# Altium schematic sheet Programmable Load.SchDoc
size 431 x 279 mm; SheetNumber: 5; SheetTotal: 6
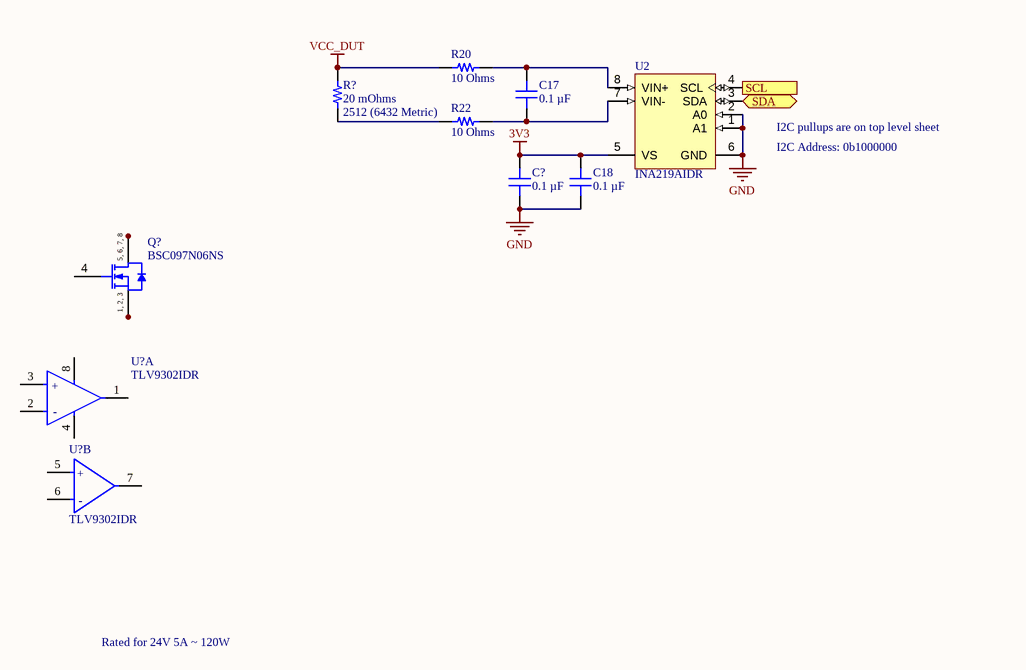
[diagram p0: Programmable Load.SchDoc]

## Parts
(Parts that share a designator on the sheet are numbered #1, #2 ... from top to bottom, then left to right.)
C17  0.1 µF  [CAP 0603_1608]
C18  0.1 µF  [CAP 0603_1608]
C?  0.1 µF  [CAP 0603_1608]
Q?  BSC097N06NS  [INF-PG-TDSON-8-04_V]
R20  10 Ohms  [RES 0603_1608]
R22  10 Ohms  [RES 0603_1608]
R?  20 mOhms  Package / Case: 2512 (6432 Metric)  [STACKPOLE CSR2512]
U2  INA219AIDR  [D0008A_L]
U?#1  TLV9302IDR  [FP-D0008A-IPC_A]  (part A of 2)
U?#2  TLV9302IDR  [FP-D0008A-IPC_A]  (part B of 2)

## Ports
SCL (in), SDA (bidir)

## Nets
3V3: C18.2 C?.2 U2.5(VS)
GND: C18.1 C?.1 U2.1(A1) U2.2(A0) U2.6(GND)
VCC_DUT: R20.1 R?.2
SCL: U2.4(SCL) ; port SCL
SDA: U2.3(SDA) ; port SDA
NetC17_1: C17.1 R22.2 U2.7(VIN-)
NetC17_2: C17.2 R20.2 U2.8(VIN+)
NetQ?_1: Q?.1(SOURCE) Q?.2(SOURCE) Q?.3(SOURCE)
NetQ?_5: Q?.5(DRAIN) Q?.6(DRAIN) Q?.7(DRAIN) Q?.8(DRAIN)
NetR22_1: R22.1 R?.1

Not connected (* = marked no-connect by the designer): Q? 4(GATE); U?#1 1(OUT1) 2(IN1-) 3(IN1+) 4(V-) 8(V+); U?#2 5(IN2+) 6(IN2-) 7(OUT2)

## Notes on the sheet
- I2C pullups are on top level sheet
- I2C Address: 0b1000000
- Rated for 24V 5A ~ 120W
- DWG. NO.
- REV.
- SHT.
- THIS DOCUMENT AND THE DATA DISCLOSED HEREIN OR HEREWITH IS THE PROPERTY OF ALTIUM LIMITED AND MAY BE FREELY DISTRIBUTED IN WHOLE. NO RIGHTS ARE RESERVED OR EXPRESS OR IMPLIED WARANTEE GIVEN.
- REVISION
- DESCRIPTION
- DATE
- APPROVED
- ENG:
- APPROVALS
- PROJECT
- DSN:
- CHK:
- REFERENCE DOCUMENTS
- PROJECT REVISION:
- TITLE
- DOCUMENT REVISION:
- DESIGN ITEM:
- BOM:
- FAB DWG:
- PCB DWG:
- ASSY DWG:
- SCALE:
- SIZE
- B
- CAGE CODE
- FILE NAME
- DWG NO.
- SHEET
- OF
- REV
- (in symbol CMP-1091-00019-1) 5, 6, 7, 8; 1, 2, 3
- (in symbol CMP-04895-000152-1, part A) +; -
- (in symbol CMP-04895-000152-1, part B) +; -

## Library data of the parts
C17 C18 C? = C0603C104K5RAC7411: CAP CER 0.1UF 50V X7R 0603; manufacturer: KEMET; Tolerance: ±10%; Part Number: C0603C104K5RAC7411; Value: 0.1 µF; Applications: Bypass, Decoupling; Capacitance: 0.1 µF; componentlink1description: Datasheet; componentlink1url: https://api.kemet.com/component-edge/download/datasheet/C0603C104K5RAC7411.pdf; componentlink2description: DigiKey Link; componentlink2url: https://www.digikey.com/en/products/detail/kemet/C0603C104K5RAC7411/3317013; Device Package: 0603 (1608 Metric); lastupdated: 2022-09-13 6:40:53 AM; Lifecycle Status: Active; Minimum Order: 15000; Mounting Type: Surface Mount, MLCC; Operating Temperature: -55°C ~ 125°C; Package / Case: 0603 (1608 Metric); packaging: TapeAndReel; partid: 2233; Part Status: Active; price: 0.01; series: SMD Comm X7R; Size / Dimension: 0.063" L x 0.031" W (1.60mm x 0.80mm); Supplier 1: DigiKey; Supplier Part Number 1: 399-7374-2-ND; Temperature Coefficient: X7R; Thickness (Max): 0.035" (0.90mm); Voltage - Rated: 50V
Q? = CMP-1091-00019-1: N-Channel OptiMOS(TM) Power-Transistor, 60 V VDS, 46 A ID, -55 to 150 degC, PG-TDSON-8, Reel, Green; Manufacturer: Infineon; RDS (on) (max): 9.7Â mOhm; VGS(th) (max): 3.3Â V; RthJA (max): 50Â K/W; VDS (max): 60Â V; Polarity: N; Green: TRUE; RthJC (max): 3.5Â K/W; Ptot (max): 36Â W; ID (max): 46Â A; IDpuls (max): 184Â A; VGS(th) (min): 2.1Â V; Technology: OptiMOS(TM); ComponentLink1Description: Manufacturer URL; PackageDescription: 8-Pin Plastic (Green) Thin Dual Small Outline Non-Leaded Package, 5.9 x 5.15 mm Body, 1.27 mm Pitch; Halogen-free: TRUE; Packing: Reel; DatasheetVersion: Rev. 2.0; ComponentLink3URL: http://www.infineon.com/dgdl/BSC019N04LS_rev2.0.pdf?folderId=db3a304313b8b5a60113cee8763b02d7&fileId=db3a304342371bb001424b8aca0c6fc4; PackageVersion: Rev. 04, 04/2013; Mounting Technology: Surface Mount; Mounting: SMD; PartNumber: BSC097N06NS; ComponentLink2URL: http://www.infineon.com/dgdl/BSC097N06NS_Rev2.0.pdf?folderId=db3a304313b8b5a60113cee8763b02d7&fileId=db3a304342371bb001424cdd69b87155; ComponentLink2Description: Datasheet; ComponentLink3Description: Package Specification; ComponentLink1URL: http://www.infineon.com/; PackageReference: PG-TDSON-8-04
R20 R22 = ERJ-PA3F10R0V: RES SMD 10 OHM 1% 1/3W 0603; Manufacturer: Panasonic Electronic Components; Power (Watts): 0.333W, 1/3W; Temperature Coefficient: ±100ppm/°C; Part Number: ERJ-PA3F10R0V; Value: 10 Ohms; ComponentLink1Description: Datasheet; ComponentLink1URL: https://industrial.panasonic.com/cdbs/www-data/pdf/RDO0000/AOA0000C331.pdf; ComponentLink2Description: DigiKey Link; ComponentLink2URL: https://www.digikey.com/en/products/detail/panasonic-electronic-components/ERJ-PA3F10R0V/5035852; Composition: Thick Film; Device Package: 0603 (1608 Metric); Features: Automotive AEC-Q200, Pulse Withstanding; Height - Seated (Max): 0.022" (0.55mm); LastUpdated: 2023-01-02 8:30:25 PM; Lifecycle Status: Active; Minimum Order: 1; Number of Terminations: 2; Operating Temperature: -55°C ~ 155°C; Package / Case: 0603 (1608 Metric); Packaging: TapeAndReel; PartId: 5368; Part Status: Active; Price: 0.01; Ratings: AEC-Q200; Resistance: 10 Ohms; Series: ERJ-PA3; Size / Dimension: 0.063" L x 0.031" W (1.60mm x 0.80mm); Supplier 1: DigiKey; Supplier Part Number 1: P10.00BYCT-ND; Supplier Device Package: 0603; Tolerance: ±1%
R? = CSRN2512FK20L0: RES 0.02 OHM 1% 2W 2512; Manufacturer: Stackpole Electronics Inc; Temperature Coefficient: ±200ppm/°C; Part Number: CSRN2512FK20L0; ComponentLink1Description: Datasheet; ComponentLink1URL: https://www.seielect.com/catalog/sei-csr_csrn.pdf; ComponentLink2Description: DigiKey Link; ComponentLink2URL: https://www.digikey.com/en/products/detail/stackpole-electronics-inc/CSRN2512FK20L0/1646105; Composition: Thick Film; Device Package: 2512 (6432 Metric); Features: Current Sense; Height - Seated (Max): 0.028" (0.70mm); LastUpdated: 2022-02-17 6:43:57 PM; Lifecycle Status: Active; Minimum Order: 1; Number of Terminations: 2; Operating Temperature: -55°C ~ 155°C; Packaging: TapeAndReel; PartId: 1775; Part Status: Active; Power (Watts): 2W; Price: 0.15; Resistance: 20 mOhms; Series: CSRN; Size / Dimension: 0.250" L x 0.124" W (6.35mm x 3.15mm); Supplier 1: DigiKey; Supplier Part Number 1: CSRN2512FK20L0CT-ND; Supplier Device Package: 2512; Tolerance: ±1%; Value: 20 mOhms
U2 = CMP-0704-00003-2: Zero-Drift, Bi-Directional Current / Power Monitor, 3 to 5.5 V, -40 to 125 degC, 8-pin SOIC (D8), Green (RoHS & no Sb/Br); Manufacturer: Texas Instruments; Common Mode Range(Min)(V): 0; SubFamily: Current Shunt Monitor; Rating: Catalog; Input Offset (+/-)(Max)(uV): 100; Vs(Max)(V): 5.5; Common Mode Range(Max)(V): 26; Quiescent Current (+/-)(Typ)(mA): 0.7; Vs(Min)(V): 3; Gain(V/V): 1, 0.5, 0.25, 0.125; Small-Signal Bandwidth(Typ)(MHz): 0.011; PackageReference: D0008A; ComponentLink1URL: http://www.ti.com/; Eco-Plan: Green (RoHS & no Sb/Br); ComponentLink2URL: http://www.ti.com/general/docs/lit/getliterature.tsp?genericPartNumber=INA219&fileType=pdf; ComponentLink1Description: Manufacturer URL; ComponentLink3Description: Package Specification; Mounting Technology: Surface Mount; PackageDescription: 8-Pin Plastic Small Outline, Body 4.9 x 3.9 mm, Pitch 1.27 mm; ComponentLink3URL: http://www.ti.com/lit/ml/msoi002j/msoi002j.pdf; DatasheetVersion: SBOS448F; PackageVersion: 4040047-3/M, 06/2011; PartNumber: INA219AIDR; Code_JEDEC: MS-012; ComponentLink2Description: Datasheet; CMRR(Min)(dB): 100
U?#1 U?#2 = CMP-04895-000152-1: IC OPAMP GP 2 CIRCUIT 8SOIC